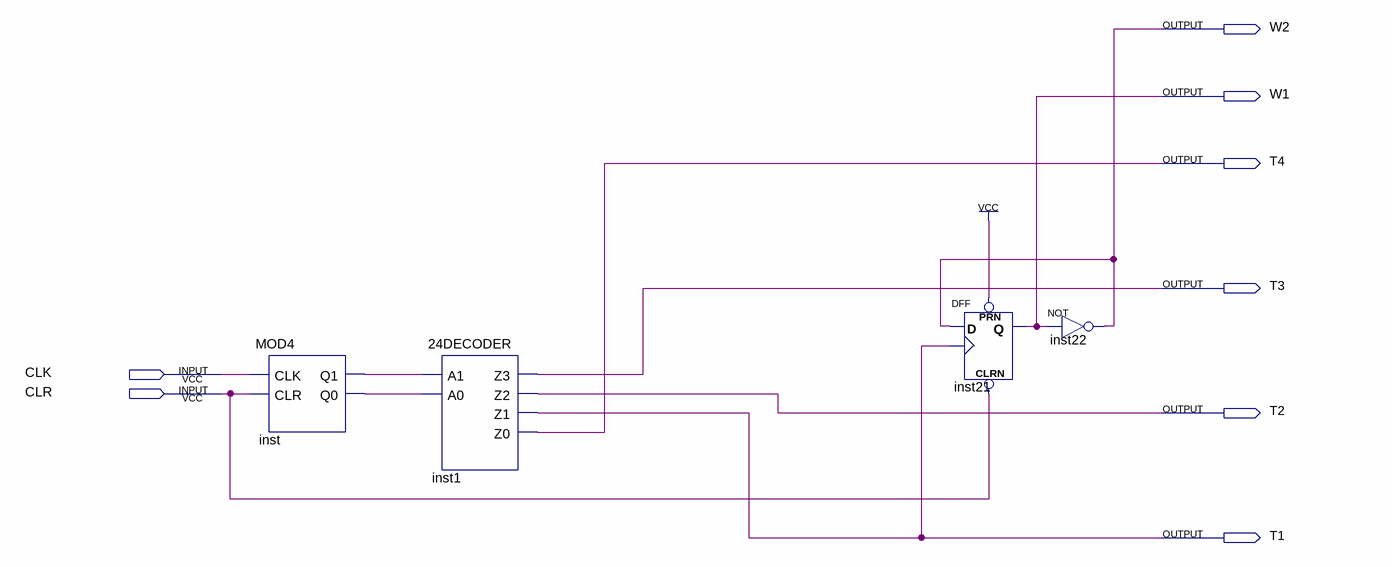
[diagram p0: schematic sheet]
// Quartus schematic JP.bdf as structural Verilog: 4 symbols, 8 pins
module JP (
  input  CLK,
  input  CLR,
  output W2,
  output W1,
  output T4,
  output T3,
  output T2,
  output T1
);

  wire inst_q0, inst_q1;

  MOD4 inst (.CLK(CLK), .CLR(CLR), .Q1(inst_q1), .Q0(inst_q0));
  \24DECODER  inst1 (.A1(inst_q1), .A0(inst_q0), .Z3(T3), .Z2(T2), .Z1(T1), .Z0(T4));
  DFF inst21 (.CLRN(CLR), .CLK(T1), .D(W2), .PRN(1'b1), .Q(W1));
  not inst22 (W2, W1);
endmodule
